# EAGLE design vmuzero_SEPS525_V2 (EAGLE 6.6.0)

## Sheet 1 of 5
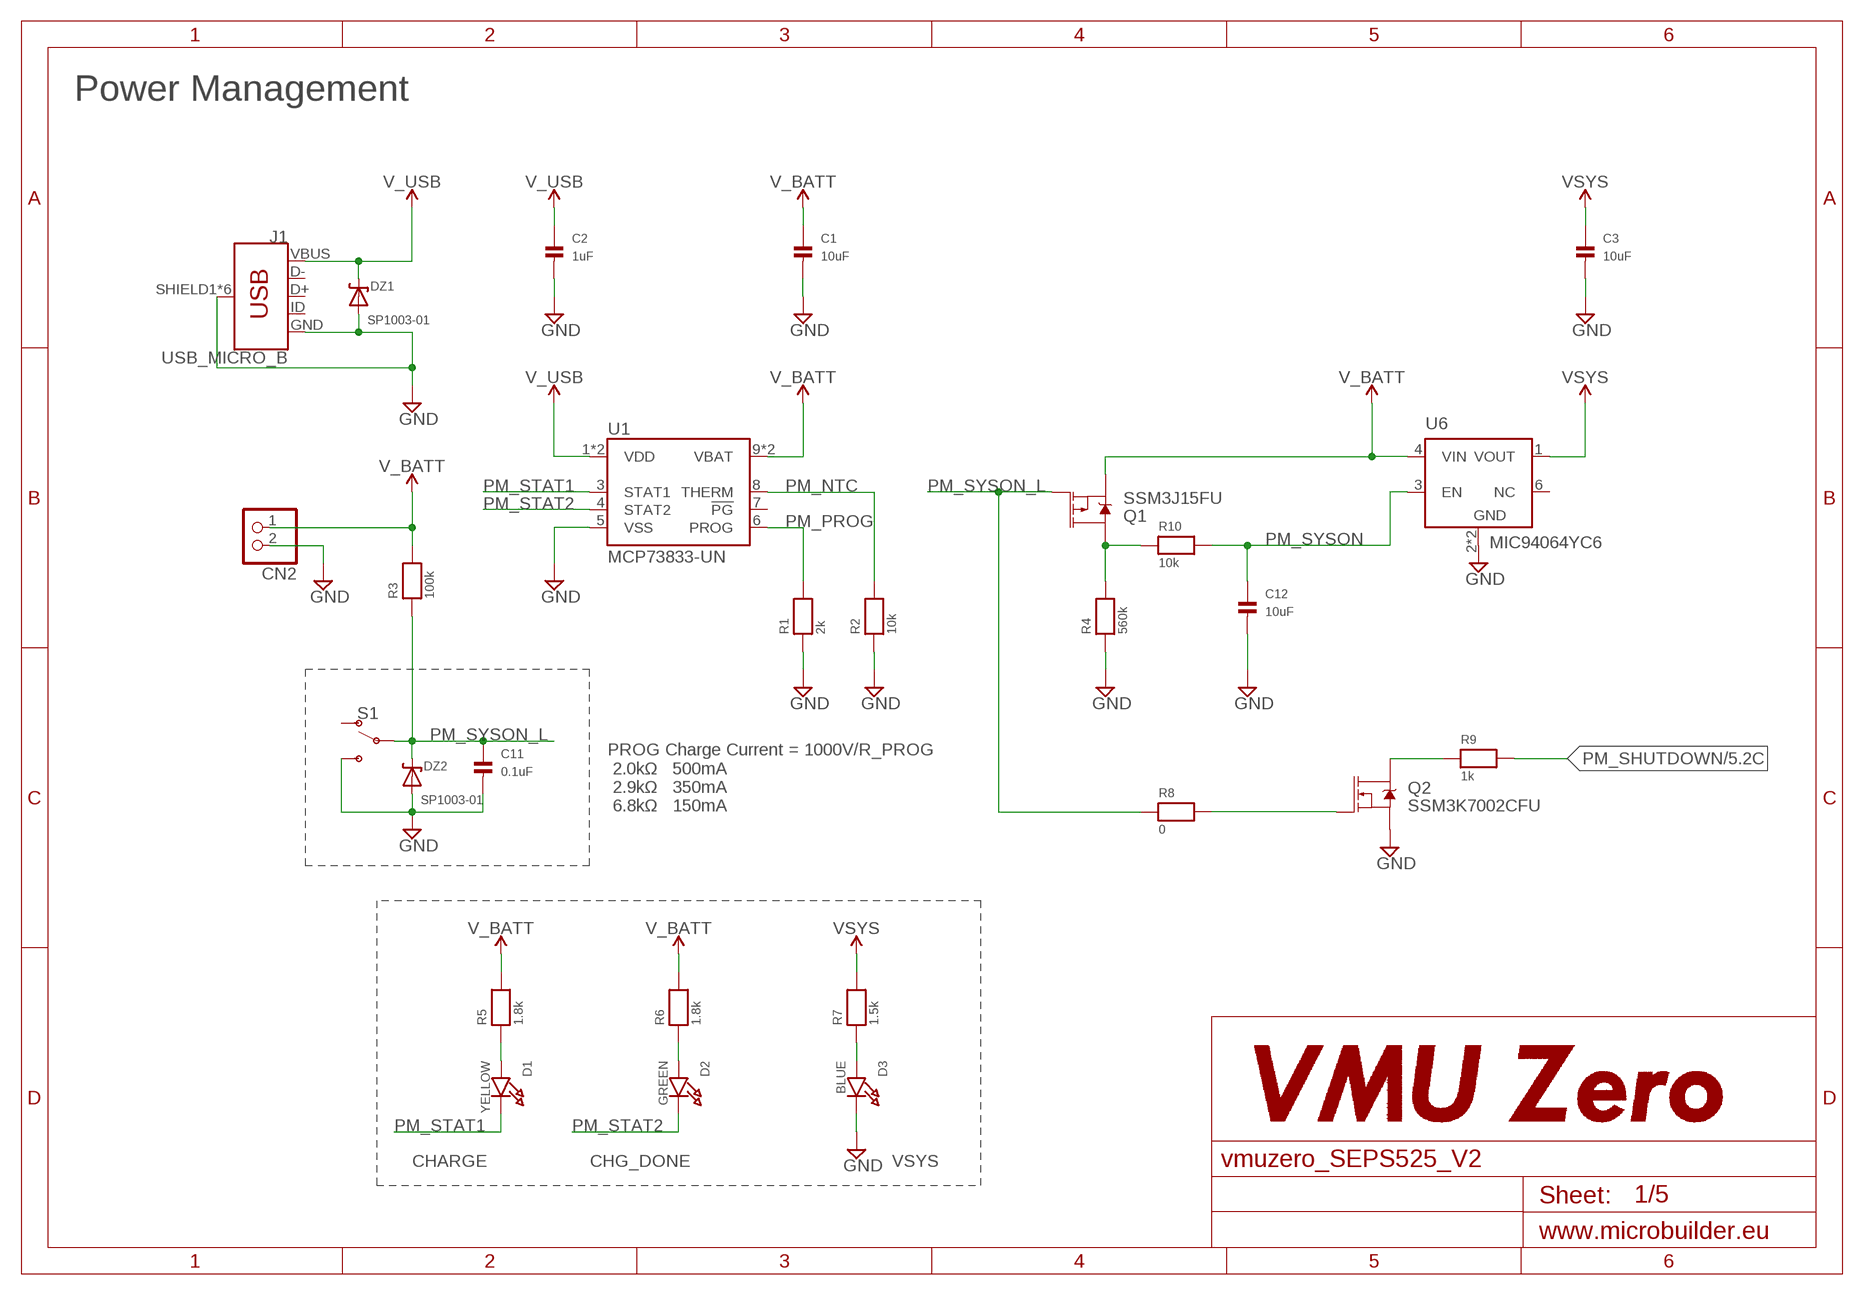
[diagram p0: schematic, sheet 1]

### Parts
C1  10uF  CAP_CERAMIC_0805MP  [_0805MP]
C2  1uF  CAP_CERAMIC_0805MP  [_0805MP]
C3  10uF  CAP_CERAMIC_0805MP  [_0805MP]
C11  0.1uF  CAP_CERAMIC_0805MP  [_0805MP]
C12  10uF  CAP_CERAMIC_0805MP  [_0805MP]
CN2  JST_2PIN  [S2B-PH-K-S]
D1  YELLOW  LED0805_NOOUTLINE  [CHIPLED_0805_NOOUTLINE]
D2  GREEN  LED0805_NOOUTLINE  [CHIPLED_0805_NOOUTLINE]
D3  BLUE  LED0805_NOOUTLINE  [CHIPLED_0805_NOOUTLINE]
DZ1  SP1003-01  SP1003-01D  [DIODE_SOD723]
DZ2  SP1003-01  SP1003-01D  [DIODE_SOD723]
J1  USB_MICRO_B  USB_MICRO-B_AMP_10118192  [USB-MICROB_10118192]
Q1  SSM3J15FU  MOSFET_PCH-SSM3J15FU  [SOT323]
Q2  SSM3K7002CFU  MOSFET_NCH-SSM3K7002CFU  [SOT323]
R1  2k  RESISTOR_0805MP  [_0805MP]
R2  10k  RESISTOR_0805MP  [_0805MP]
R3  100k  RESISTOR_0805MP  [_0805MP]
R4  560k  RESISTOR_0805MP  [_0805MP]
R5  1.8k  RESISTOR_0805MP  [_0805MP]
R6  1.8k  RESISTOR_0805MP  [_0805MP]
R7  1.5k  RESISTOR_0805MP  [_0805MP]
R8  0  RESISTOR_0805MP  [_0805MP]
R9  1k  RESISTOR_0805MP  [_0805MP]
R10  10k  RESISTOR_0805MP  [_0805MP]
S1  SWITCH-SPDT  [SPDT_JS102011SAQN]
U1  MCP73833-UN  [10L_MSOP]
U6  MIC94064YC6  [SC70-6L]

### Nets
GND: C1.2 C2.2 C3.2 C11.2 C12.2 CN2.2 D3.C DZ1.A DZ2.A J1.GND J1.SHIELD1(SHIELD) J1.SHIELD2(SHIELD) J1.SHIELD3(SHIELD) J1.SHIELD4(SHIELD) J1.SHIELD5(SHIELD) J1.SHIELD6(SHIELD) Q2.2(S) R1.1 R2.1 R4.1 S1.P$3(S) U1.5(VSS) U6.2(GND) U6.5(GND) ; also sheet 2,3,4,5
N$1: D1.A R5.1
N$2: Q2.3(D) R9.1
N$5: D3.A R7.1
N$6: D2.A R6.1
N$21: Q2.1(G) R8.2
N$22: Q1.3(D) R4.2 R10.1
PM_NTC: R2.2 U1.8(THERM)
PM_PROG: R1.2 U1.6(PROG)
PM_SHUTDOWN: R9.2 ; also sheet 5
PM_STAT1: D1.C U1.3(STAT1)
PM_STAT2: D2.C U1.4(STAT2)
PM_SYSON: C12.1 R10.2 U6.3(EN)
PM_SYSON_L: C11.1 DZ2.C Q1.1(G) R3.1 R8.1 S1.P$2(P)
V_BATT: C1.1 CN2.1 Q1.2(S) R3.2 R5.2 R6.2 U1.9(VBAT) U1.10(VBAT) U6.4(VIN)
V_USB: C2.1 DZ1.C J1.VBUS U1.1(VDD) U1.2(VDD)
VSYS: C3.1 R7.2 U6.1(VOUT) ; also sheet 2,5
Unconnected: J1.D+ J1.D- J1.ID S1.P$1(O) U1.7(!PG) U6.6(NC)

### Notes on the sheet
- Power Management
- PROG Charge Current = 1000V/R_PROG
   2.0kΩ   500mA
   2.9kΩ   350mA
   6.8kΩ   150mA
- CHARGE | CHG_DONE | VSYS

## Sheet 2 of 5
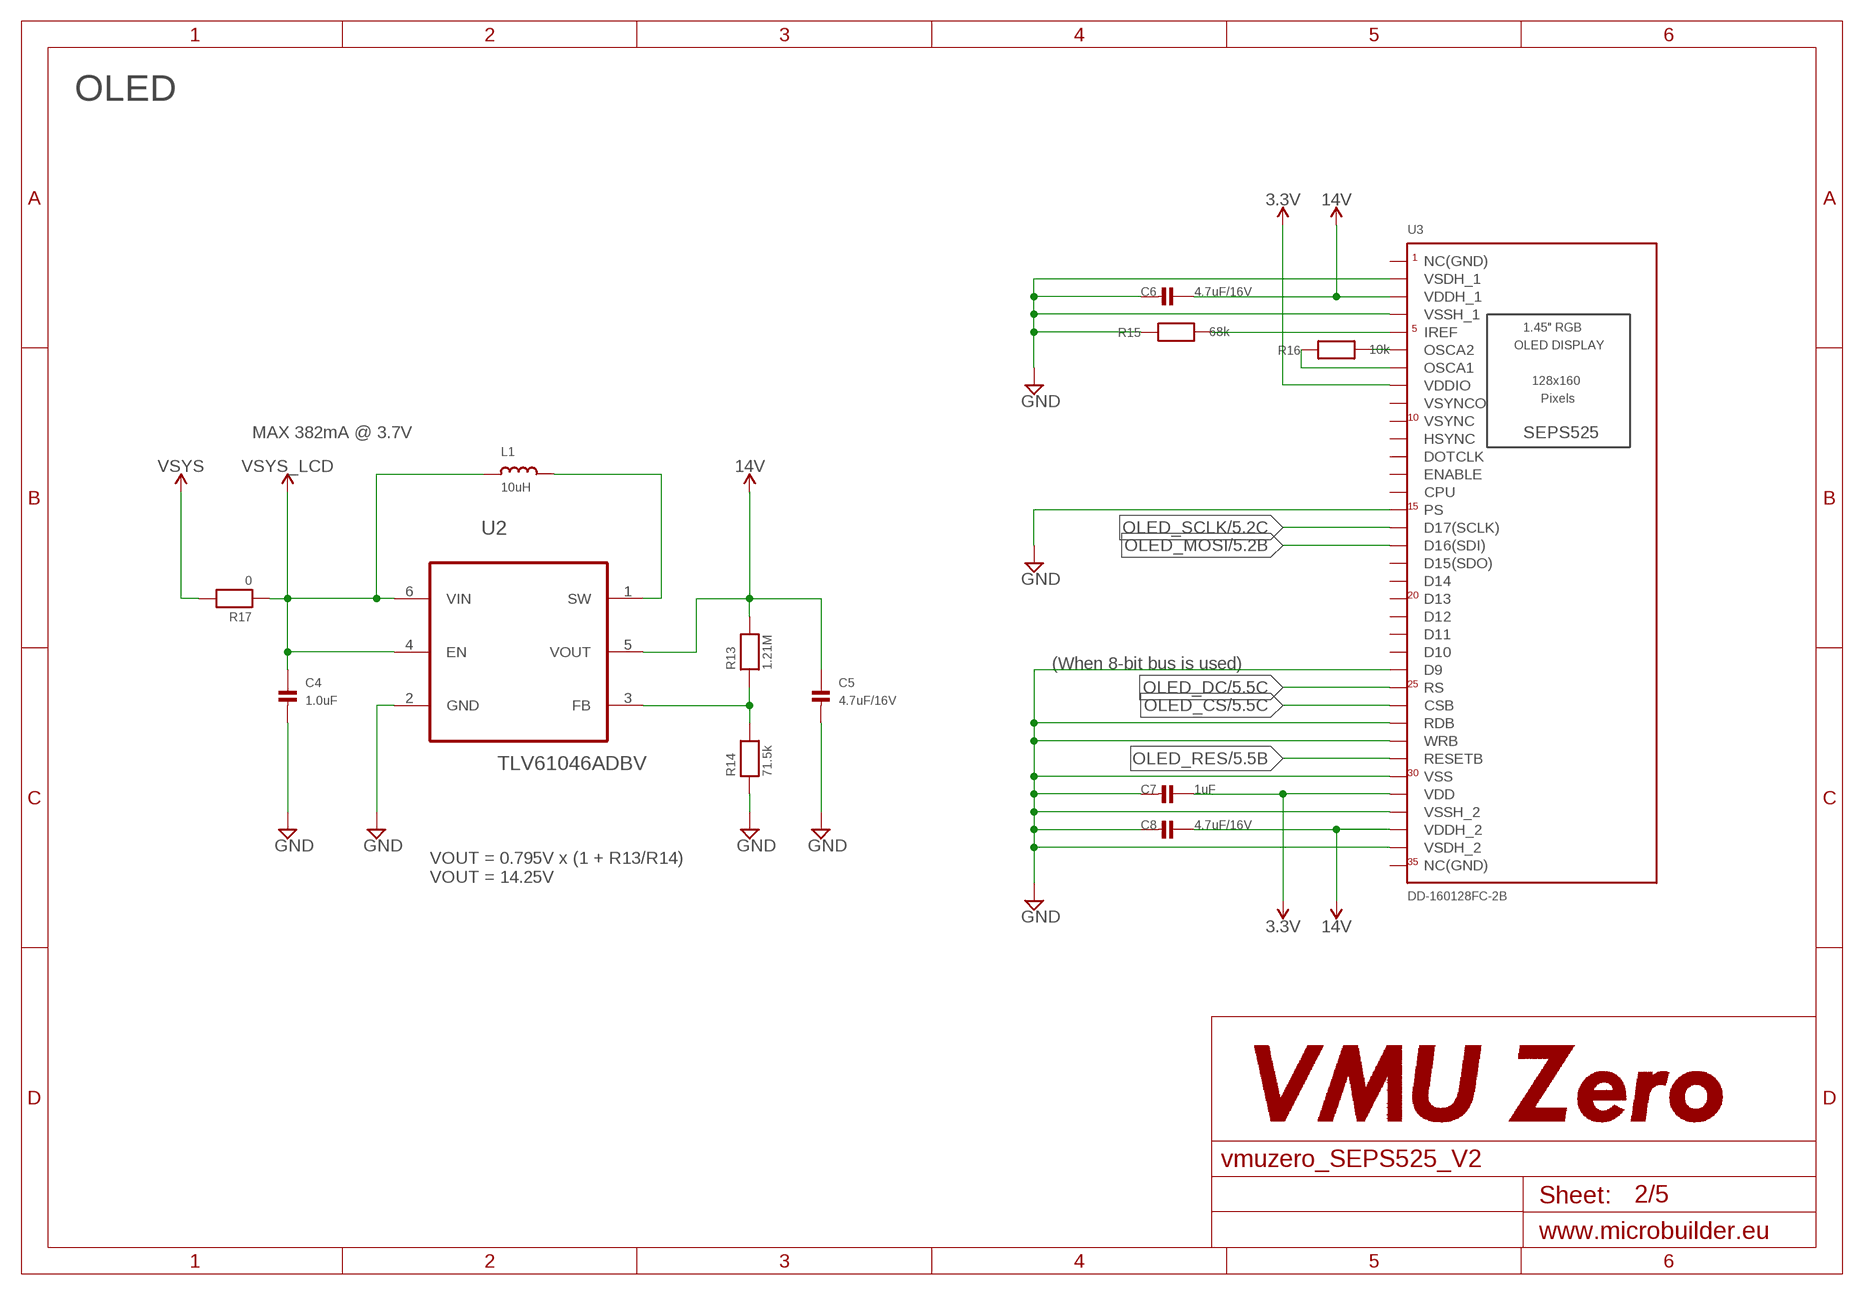
[diagram p1: schematic, sheet 2]

### Parts
C4  1.0uF  CAP_CERAMIC_0805MP  [_0805MP]
C5  4.7uF/16V  CAP_CERAMIC_0805MP  [_0805MP]
C6  4.7uF/16V  CAP_CERAMIC_0805MP  [_0805MP]
C7  1uF  CAP_CERAMIC_0805MP  [_0805MP]
C8  4.7uF/16V  CAP_CERAMIC_0805MP  [_0805MP]
L1  10uH  INDUCTOR_CIG22L  [CIG22L]
R13  1.21M  RESISTOR_0805MP  [_0805MP]
R14  71.5k  RESISTOR_0805MP  [_0805MP]
R15  68k  RESISTOR_0805MP  [_0805MP]
R16  10k  RESISTOR_0805MP  [_0805MP]
R17  0  RESISTOR_0805MP  [_0805MP]
U2  TLV61046ADBV  [R-PDSO-G6]
U3  DD-160128FC-2B  DISP_OLED_DD-160128FC-2BNOSWAP  [XF2M-3515-1A]

### Nets
3.3V: C7.1 U3.8(VDDIO) U3.31(VDD) ; also sheet 5
14V: C5.1 C6.1 C8.1 R13.2 U2.5(VOUT) U3.3(VDDH_1) U3.33(VDDH_2) ; also sheet 4
GND: C4.2 C5.2 C6.2 C7.2 C8.2 R14.1 R15.2 U2.2(GND) U3.2(VSDH_1) U3.4(VSSH_1) U3.15(PS) U3.24(D9) U3.27(RDB) U3.28(WRB) U3.30(VSS) U3.32(VSSH_2) U3.34(VSDH_2) ; also sheet 1,3,4,5
N$7: R15.1 U3.5(IREF)
N$8: L1.P$2 U2.1(SW)
N$9: R13.1 R14.2 U2.3(FB)
N$10: R16.1 U3.6(OSCA2)
N$11: R16.2 U3.7(OSCA1)
OLED_CS: U3.26(CSB) ; also sheet 5
OLED_DC: U3.25(RS) ; also sheet 5
OLED_MOSI: U3.17(D16(SDI)) ; also sheet 5
OLED_RES: U3.29(RESETB) ; also sheet 5
OLED_SCLK: U3.16(D17(SCLK)) ; also sheet 5
VSYS: R17.2 ; also sheet 1,5
VSYS_LCD: C4.1 L1.P$1 R17.1 U2.4(EN) U2.6(VIN)
Unconnected: U3.1(NC(GND)) U3.9(VSYNCO) U3.10(VSYNC) U3.11(HSYNC) U3.12(DOTCLK) U3.13(ENABLE) U3.14(CPU) U3.18(D15(SDO)) U3.19(D14) U3.20(D13) U3.21(D12) U3.22(D11) U3.23(D10) U3.35(NC(GND))

### Notes on the sheet
- OLED
- MAX 382mA @ 3.7V
- (When 8-bit bus is used)
- VOUT = 0.795V x (1 + R13/R14)
  VOUT = 14.25V

## Sheet 3 of 5
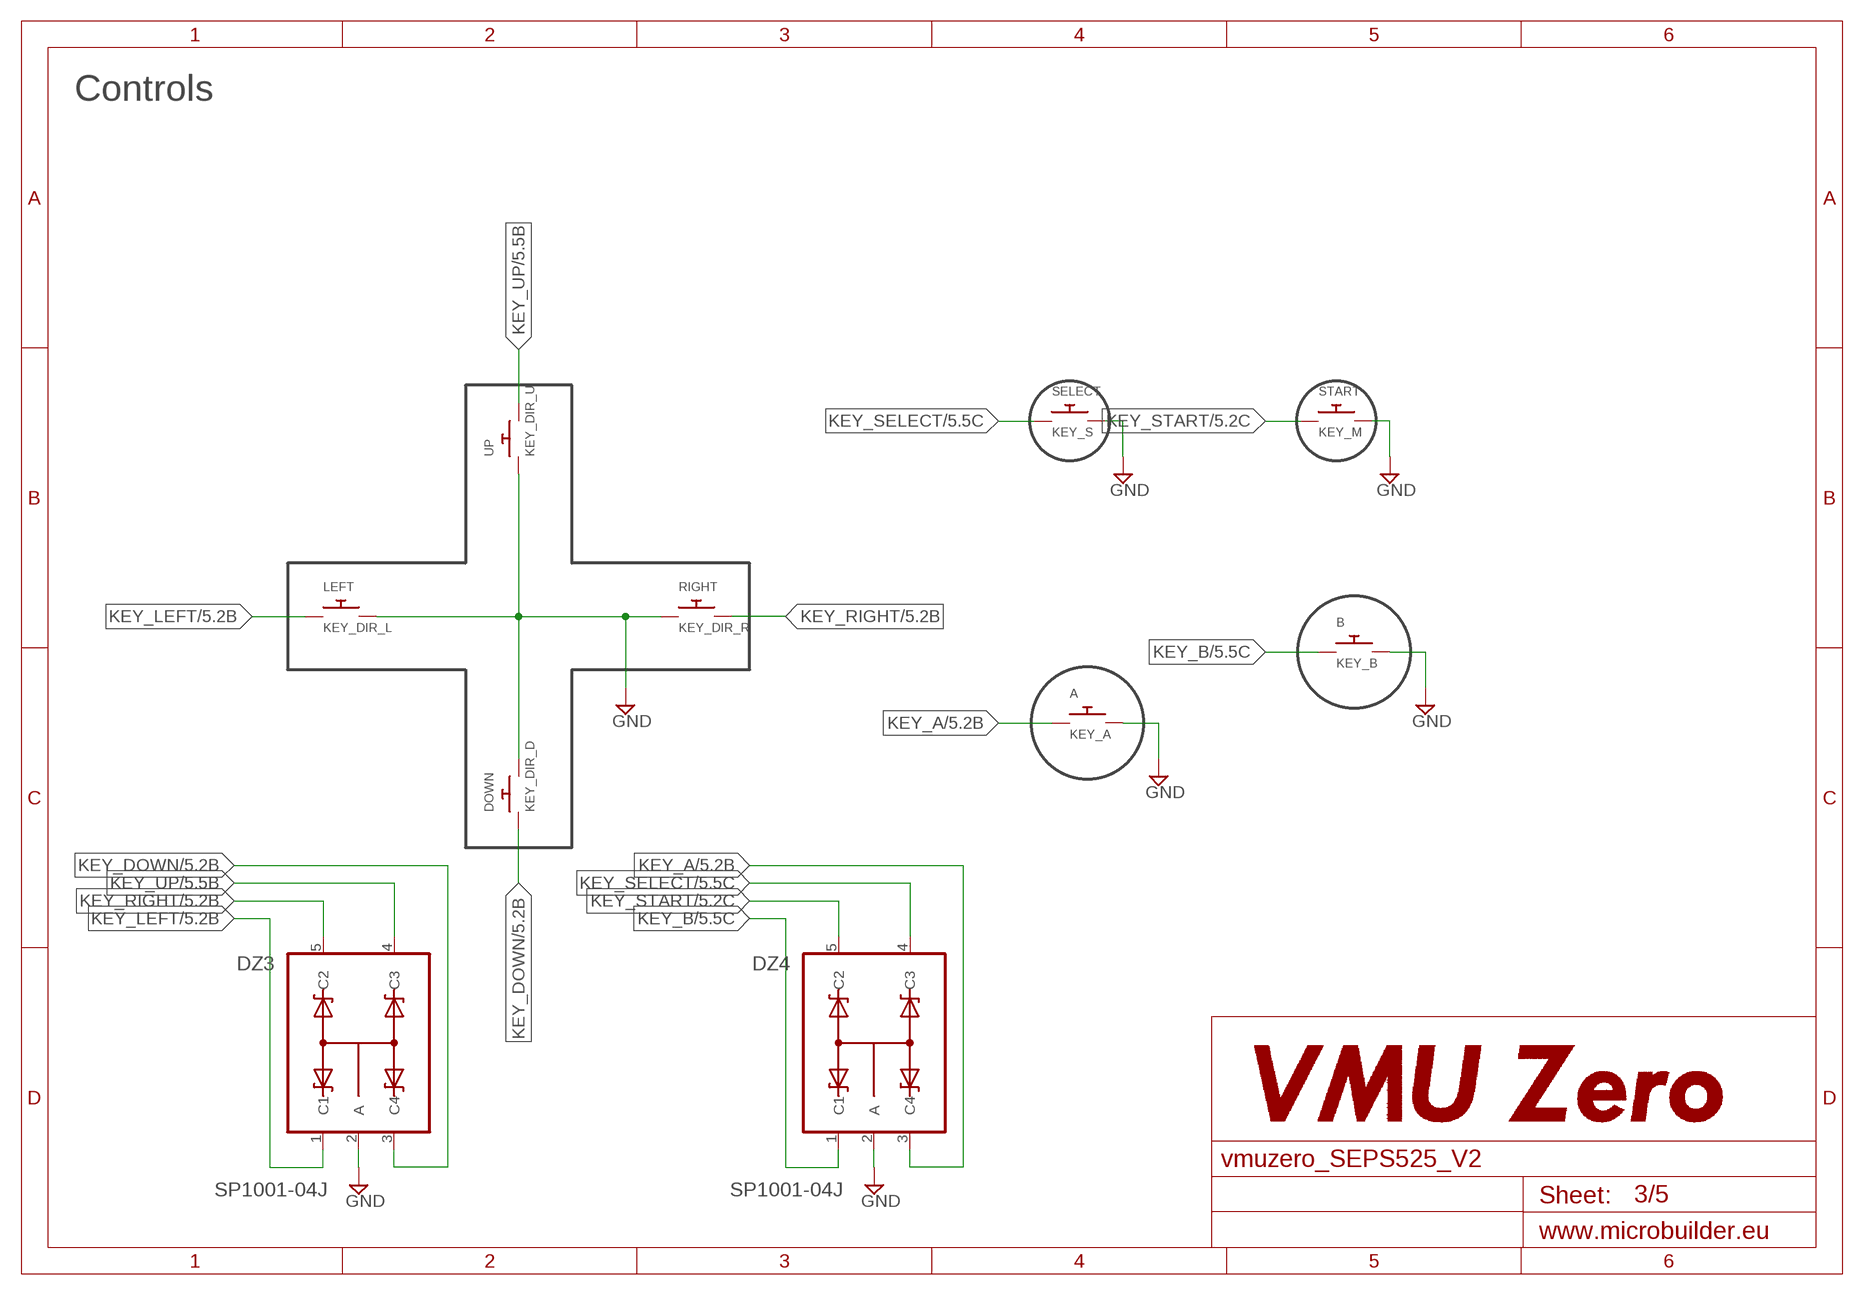
[diagram p2: schematic, sheet 3]

### Parts
A  KEY_A  SWITCH_PUSH_VMU  [KEYPAD_VMU_R26]
B  KEY_B  SWITCH_PUSH_VMU  [KEYPAD_VMU_R26]
DOWN  KEY_DIR_D  SWITCH_PUSH_VMU  [KEYPAD_VMU_R26]
DZ3  SP1001-04J  [SC70-5]
DZ4  SP1001-04J  [SC70-5]
LEFT  KEY_DIR_L  SWITCH_PUSH_VMU  [KEYPAD_VMU_R26]
RIGHT  KEY_DIR_R  SWITCH_PUSH_VMU  [KEYPAD_VMU_R26]
SELECT  KEY_S  SWITCH_PUSH_VMU  [KEYPAD_VMU_R26]
START  KEY_M  SWITCH_PUSH_VMU  [KEYPAD_VMU_R26]
UP  KEY_DIR_U  SWITCH_PUSH_VMU  [KEYPAD_VMU_R26]

### Nets
GND: A.2 B.2 DOWN.2 DZ3.2(A) DZ4.2(A) LEFT.2 RIGHT.1 SELECT.2 START.2 UP.1 ; also sheet 1,2,4,5
KEY_A: A.1 DZ4.3(C4) ; also sheet 5
KEY_B: B.1 DZ4.1(C1) ; also sheet 5
KEY_DOWN: DOWN.1 DZ3.3(C4) ; also sheet 5
KEY_LEFT: DZ3.1(C1) LEFT.1 ; also sheet 5
KEY_RIGHT: DZ3.5(C2) RIGHT.2 ; also sheet 5
KEY_SELECT: DZ4.4(C3) SELECT.1 ; also sheet 5
KEY_START: DZ4.5(C2) START.1 ; also sheet 5
KEY_UP: DZ3.4(C3) UP.2 ; also sheet 5

### Notes on the sheet
- Controls

## Sheet 4 of 5
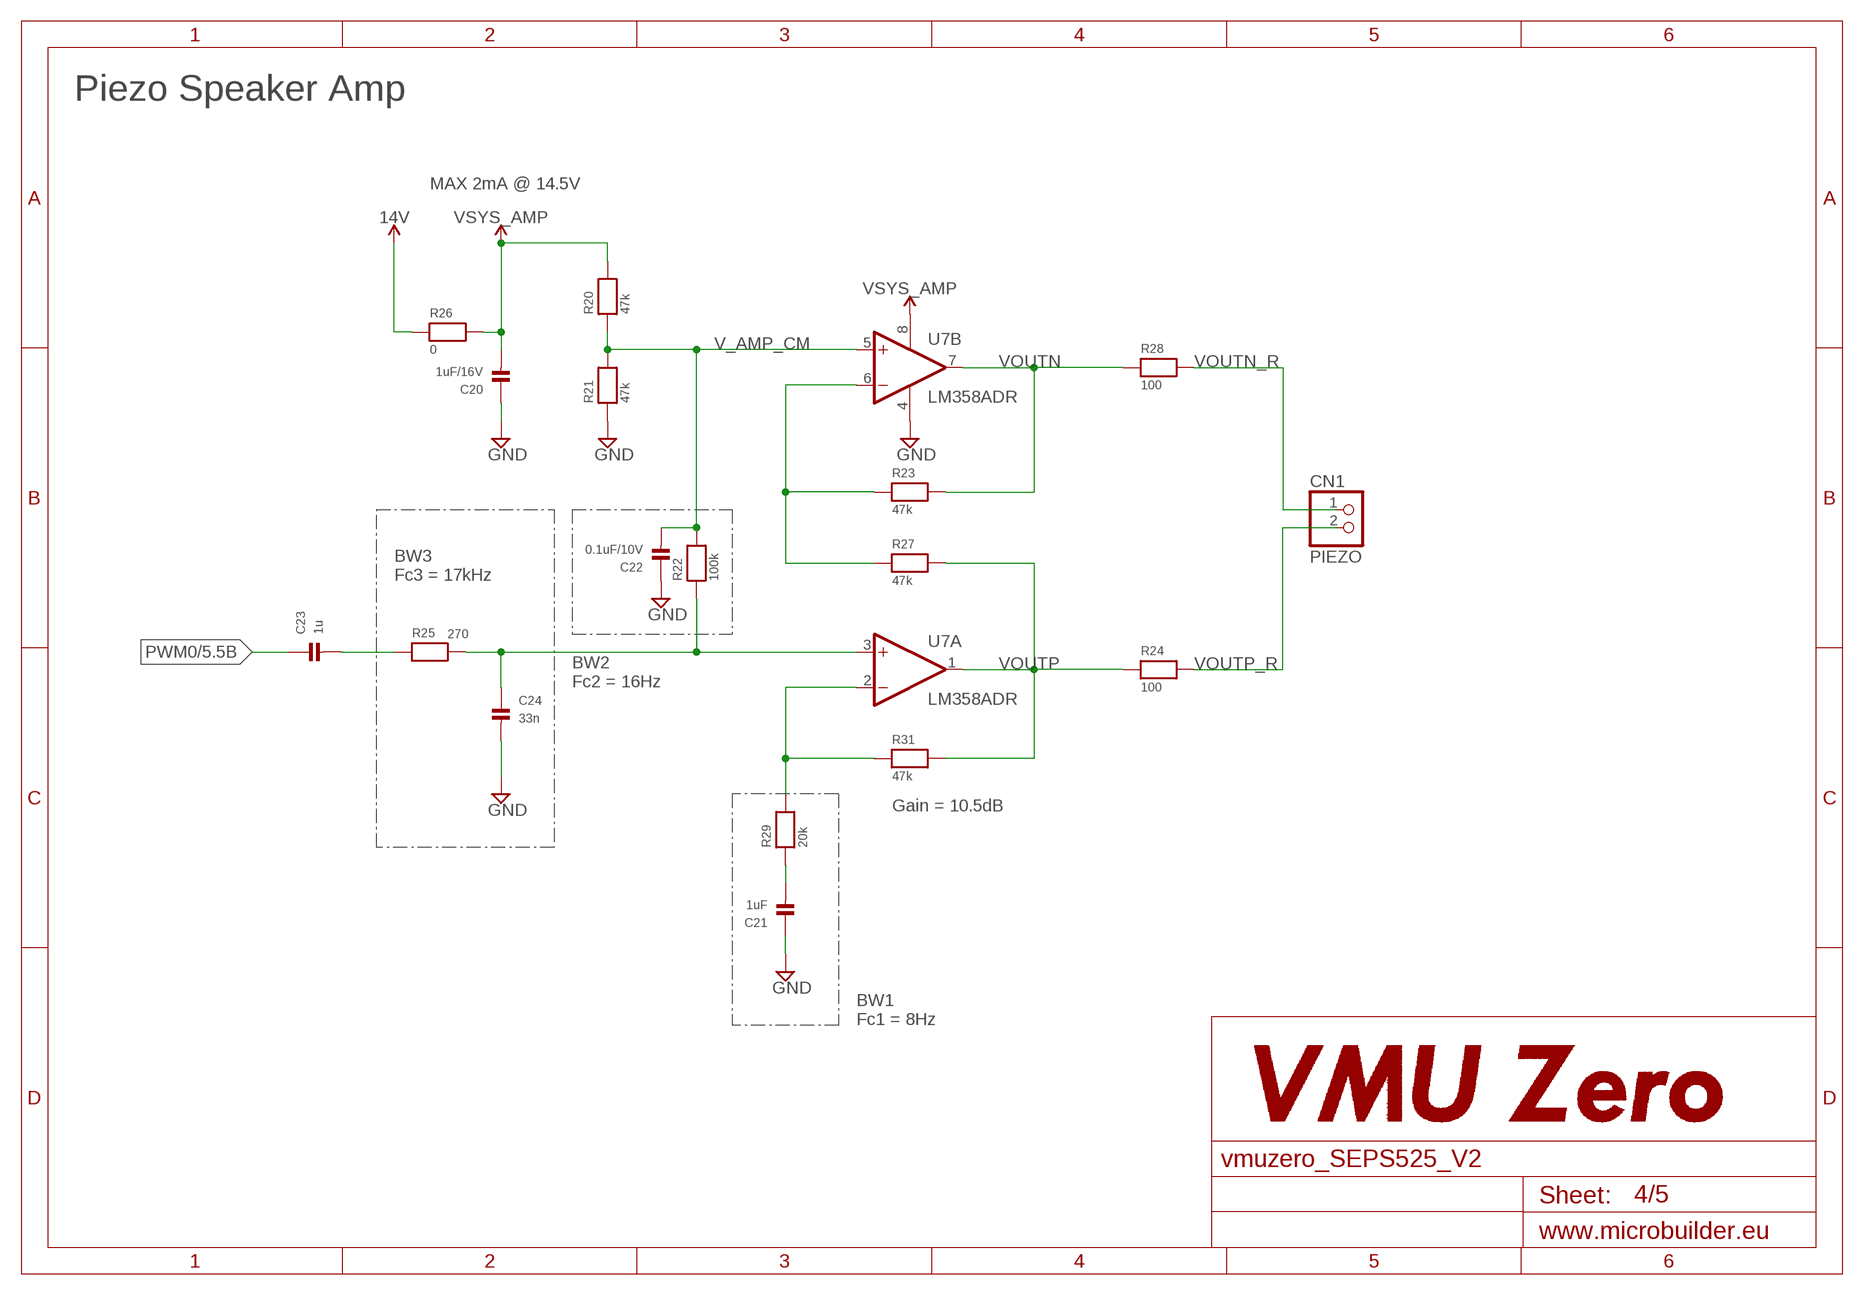
[diagram p3: schematic, sheet 4]

### Parts
C20  1uF/16V  CAP_CERAMIC_0805MP  [_0805MP]
C21  1uF  CAP_CERAMIC_0805MP  [_0805MP]
C22  0.1uF/10V  CAP_CERAMIC_0805MP  [_0805MP]
C23  1u  CAP_CERAMIC_0805MP  [_0805MP]
C24  33n  CAP_CERAMIC_0805MP  [_0805MP]
CN1  PIEZO  HEADER-1X2ROUND  [1X02_ROUND]
R20  47k  RESISTOR_0805MP  [_0805MP]
R21  47k  RESISTOR_0805MP  [_0805MP]
R22  100k  RESISTOR_0805MP  [_0805MP]
R23  47k  RESISTOR_0805MP  [_0805MP]
R24  100  RESISTOR_0805MP  [_0805MP]
R25  270  RESISTOR_0805MP  [_0805MP]
R26  0  RESISTOR_0805MP  [_0805MP]
R27  47k  RESISTOR_0805MP  [_0805MP]
R28  100  RESISTOR_0805MP  [_0805MP]
R29  20k  RESISTOR_0805MP  [_0805MP]
R31  47k  RESISTOR_0805MP  [_0805MP]
U7  LM358ADR  [SO08]

### Nets
14V: R26.1 ; also sheet 2
GND: C20.1 C21.1 C22.1 C24.2 R21.1 U7.4(P:V-) ; also sheet 1,2,3,5
N$3: C23.2 R25.1
N$12: R29.2 R31.1 U7.2(A:-IN)
N$13: C21.2 R29.1
N$16: R23.1 R27.1 U7.6(B:-IN)
N$20: C24.1 R22.1 R25.2 U7.3(A:+IN)
PWM0: C23.1 ; also sheet 5
V_AMP_CM: C22.2 R20.1 R21.2 R22.2 U7.5(B:+IN)
VOUTN: R23.2 R28.1 U7.7(B:OUT)
VOUTN_R: CN1.1 R28.2
VOUTP: R24.1 R27.2 R31.2 U7.1(A:OUT)
VOUTP_R: CN1.2 R24.2
VSYS_AMP: C20.2 R20.2 R26.2 U7.8(P:V+)

### Notes on the sheet
- Piezo Speaker Amp
- MAX 2mA @ 14.5V
- BW3
  Fc3 = 17kHz
- BW2
  Fc2 = 16Hz
- Gain = 10.5dB
- BW1
  Fc1 = 8Hz

## Sheet 5 of 5
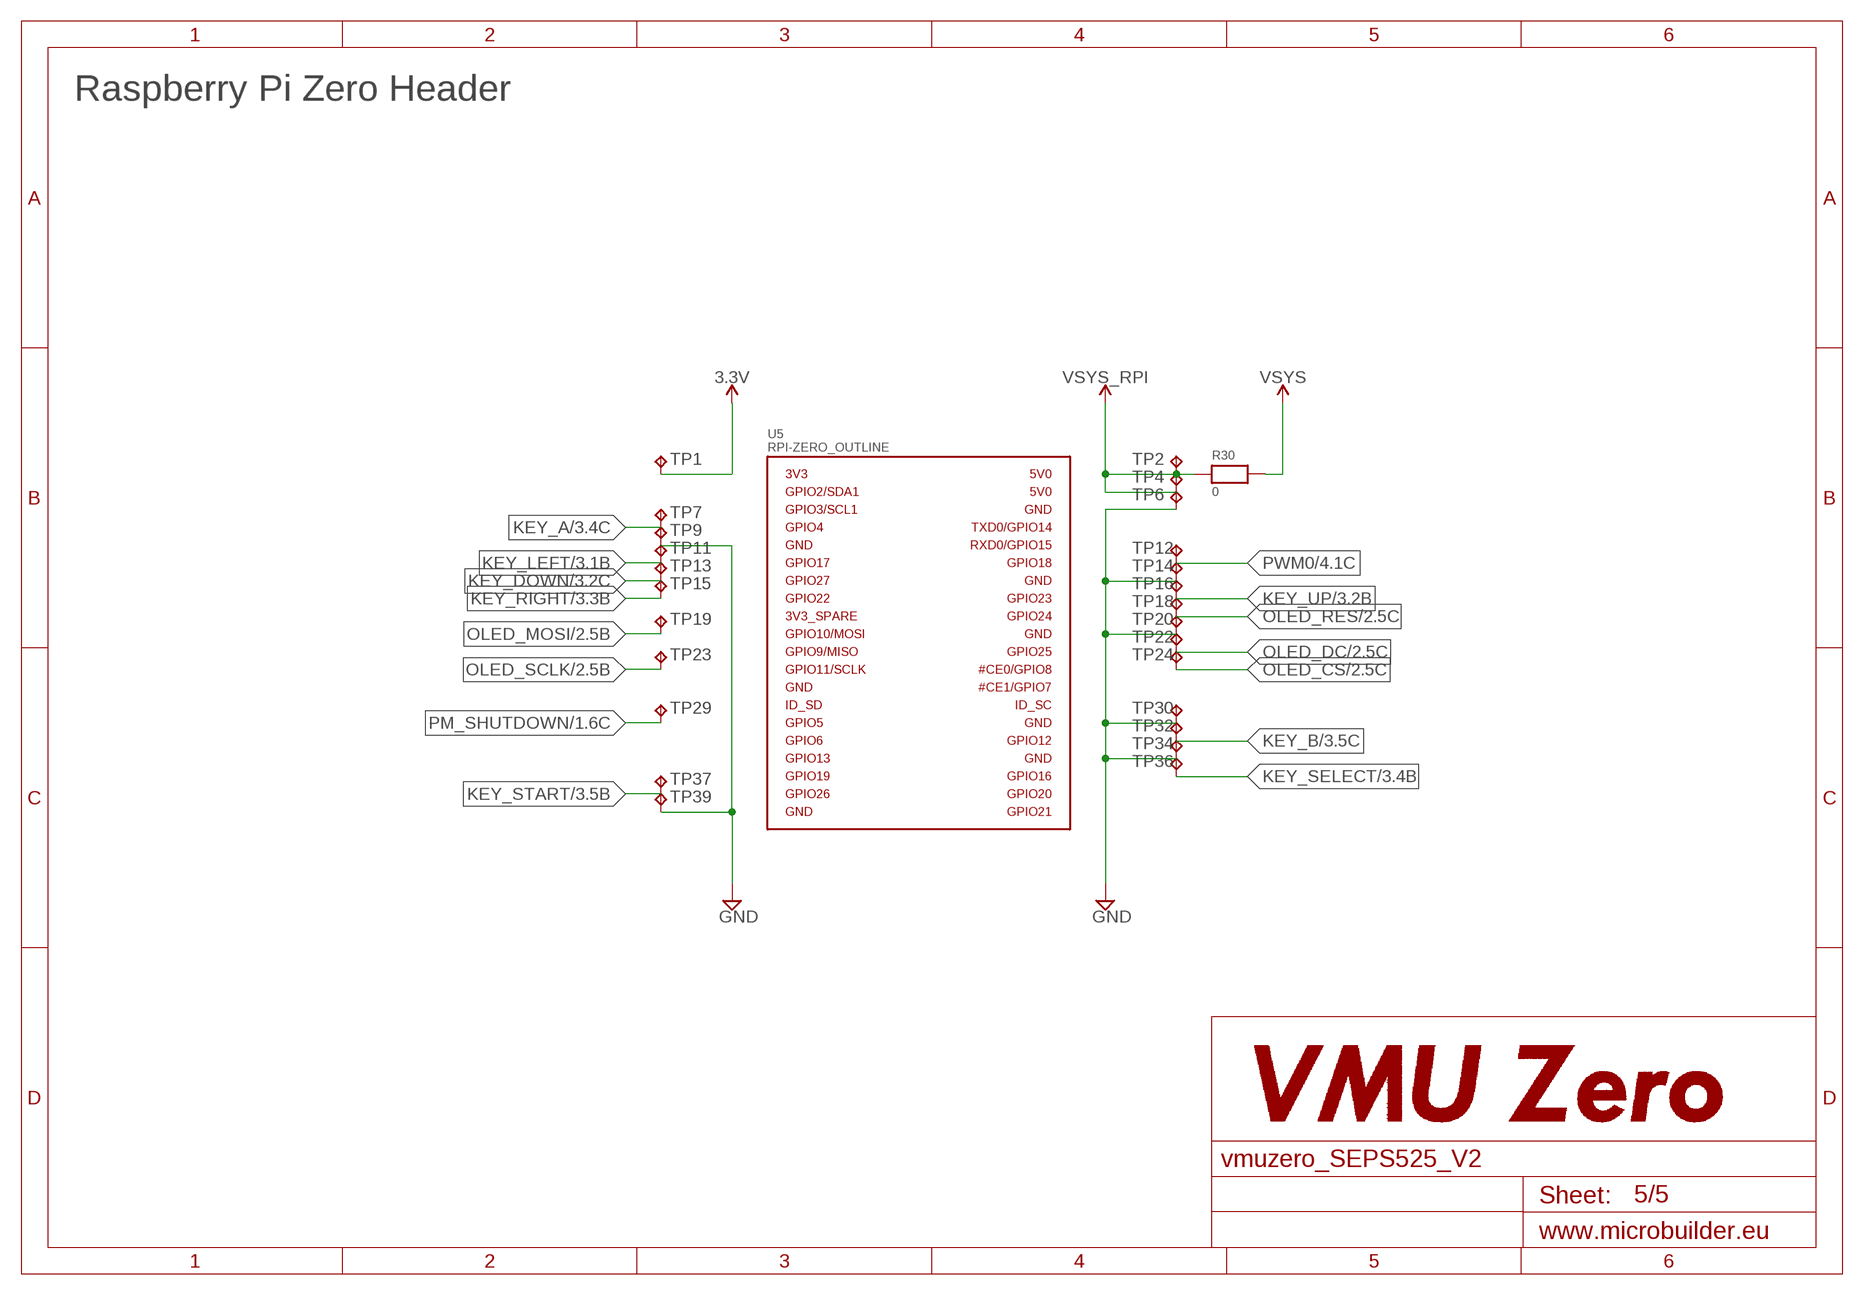
[diagram p4: schematic, sheet 5]

### Parts
R30  0  RESISTOR_0805MP  [_0805MP]
TP1  TPTP14SQ  [TP14SQ]
TP2  TPTP14R  [TP14R]
TP4  TPTP14R  [TP14R]
TP6  TPTP14R  [TP14R]
TP7  TPTP14R  [TP14R]
TP9  TPTP14R  [TP14R]
TP11  TPTP14R  [TP14R]
TP12  TPTP14R  [TP14R]
TP13  TPTP14R  [TP14R]
TP14  TPTP14R  [TP14R]
TP15  TPTP14R  [TP14R]
TP16  TPTP14R  [TP14R]
TP18  TPTP14R  [TP14R]
TP19  TPTP14R  [TP14R]
TP20  TPTP14R  [TP14R]
TP22  TPTP14R  [TP14R]
TP23  TPTP14R  [TP14R]
TP24  TPTP14R  [TP14R]
TP29  TPTP14R  [TP14R]
TP30  TPTP14R  [TP14R]
TP32  TPTP14R  [TP14R]
TP34  TPTP14R  [TP14R]
TP36  TPTP14R  [TP14R]
TP37  TPTP14R  [TP14R]
TP39  TPTP14R  [TP14R]
U5  RPI-ZERO_OUTLINE  [RASP_PI_ZERO_OUTLINE_SMD]

### Nets
3.3V: TP1.TP ; also sheet 2
GND: TP6.TP TP9.TP TP14.TP TP20.TP TP30.TP TP34.TP TP39.TP ; also sheet 1,2,3,4
KEY_A: TP7.TP ; also sheet 3
KEY_B: TP32.TP ; also sheet 3
KEY_DOWN: TP13.TP ; also sheet 3
KEY_LEFT: TP11.TP ; also sheet 3
KEY_RIGHT: TP15.TP ; also sheet 3
KEY_SELECT: TP36.TP ; also sheet 3
KEY_START: TP37.TP ; also sheet 3
KEY_UP: TP16.TP ; also sheet 3
OLED_CS: TP24.TP ; also sheet 2
OLED_DC: TP22.TP ; also sheet 2
OLED_MOSI: TP19.TP ; also sheet 2
OLED_RES: TP18.TP ; also sheet 2
OLED_SCLK: TP23.TP ; also sheet 2
PM_SHUTDOWN: TP29.TP ; also sheet 1
PWM0: TP12.TP ; also sheet 4
VSYS: R30.2 ; also sheet 1,2
VSYS_RPI: R30.1 TP2.TP TP4.TP

### Notes on the sheet
- Raspberry Pi Zero Header

## Library data of the parts
A B DOWN LEFT RIGHT SELECT START UP = vmuzero:SWITCH_PUSH_VMU: Buttons SWITCH_PUSH_VMU - Soft touch temporary push button for VMU
C1-C8 C11 C12 C20-C24 = microbuilder:CAP_CERAMIC: Ceramic Capacitors 0402 - 0402 Surface Mount Capacitors 16pF 50V 5% [Digikey: 445-4899-2-ND] 18pF 50V 5% [Digikey: 490-1281-2-ND] 22pF 50V 5% [Digikey: 490-1283-2-ND] 68pF 50V 5% [Digikey: 490-1289-2-ND] 0.1uF 10V 10% [Digikey: 490-1318-2-ND] 1.0uF 6.3V 10% [Digikey: 490-1320-2-ND] 0603 - 0603 Surface Mount Capacitors 16 pF 50V 5% [Digikey: 445-5051-2-ND] 22 pF 50V [Digikey: PCC220ACVTR-ND] 33 pF 50V 5% [Digikey: 490-1415-1-ND] 56pF 50V 5% [Digikey: 490-1421-1-ND] 220pF 50V 5% [Digikey: 445-1285-1-ND] 680 pF 50V 2200 pF 50V 5% C0G [Digikey: 445-1297-1-ND] 5600 pF 100V 5% X7R [Digikey: 478-3711-1-ND] 0.1 µF 25V 10% [Digikey: PCC2277TR-ND] 0.22 µF 16V 10% X7R [Digikey: 445-1318-1-ND] 1.0 µF 25V 10% [Digikey: 445-5146-2-ND] 0603 - RF Specific 3pF 250V +/-0.1pF RF [Digikey: 712-1347-1-ND] 18 pF 250V 5% [Digikey: 478-3505-1-ND or 712-1322-1-ND] 56 pF 250V 5% C0G RF [Digikey: 490-4867-1-ND] 68 pF 250V RF [Digikey: 490-4868-1-ND] 0805 - 0805 Surface Mount Capacitors 220 pF 250V 2% RF Ceramic Capacitor [Digikey: 712-1398-1-ND] 1000 pF 50V 2% NP0 Ceramic Capacitor [Digikey: 478-3760-1-ND] 0.1 µF 25V 10% Ceramic Capacitor [Digikey: PCC1828TR-ND] 1.0 µF 16V 10% Ceramic Capacitor[Digikey: 490-1691-2-ND] 10.0 µF 10V 10% Ceramic Capacitor[Digikey: 709-1228-1-ND] 10.0 uF 16V 10% Ceramic Capacitor [Digikey: 478-5165-2-ND] 47 uF 6.3V 20% Ceramic Capacitor [Digikey: 587-1779-1-ND or 399-5506-1-ND] 1206 - 1206 Surface Mount Capacitors 47uF 10V 20% Ceramic Capacitor [Digikey: 490-5528-1-ND or 399-5508-1-ND or 445-6010-1-ND] 100uF 6.3V -20%, +80% Y5V Ceramic Capacitor (Digikey: 490-4512-1-ND, Mouser: 81-GRM31CF50J107ZE1L)
CN1 = microbuilder:HEADER-1X2: PIN HEADER
CN2 = vmuzero:JST_2PIN: JST 2-Pin Connectors of various flavors SMT-RA (S2B-PH-SM4) 4UConnector #17311 SMT (B2B-PH-SM4) THM-RA (S2B-PH) THM (B2B-PH)
D1-D3 = microbuilder:LED: LED 0603 - 0603 Surface Mount Package 2mA: Green LED - Low Power (3.9mcd, 2ma, 1.7Vf) - Digikey: 475-2709-2-ND Orange LED - Low Power (9.8mcd, 2ma, 1.8Vf) - Digikey: 475-1194-2-ND Red LED - Low Power (5mcd, 2ma, 1.8Vf) - Digikey: 475-1195-2-ND Yellow LED - Low Power (7mcd, 2ma, 1.8Vf) - Digikey: 475-1196-2-ND 5mA: Blue LED - Low Power (17mcd, 5ma, 2.9Vf) - Digikey: LNJ937W8CRACT-ND 0805 - 0805 Surface Mount Package 2mA: Red LED (8.8mcd, 2mA, 1.8Vf, Clear) - Low Power [Digikey: 475-2510-1-ND] Green LED (5mcd, 2mA, 1.8Vf, Clear) - Low Power [Digikey: 475-2730-1-ND] Yellow LED (11.3mcd, 2mA, 1.8Vf, Clear) - Low Power [Digikey: 475-2555-1-ND] 20mA: Red LED (104mcd, 20mA, Diffused) - LS R976 [Digikey: 475-1278-6-ND] Red LED (12mcd, 20mA, 2.0Vf, Clear) - APT2012EC [Digikey: 754-1128-1-ND] Green LED (15mcd, 20mA, 2.2Vf, Clear) - APT2012GC [Digikey: 754-1131-1-ND] Orange LED (160mcd, 20mA, 2.1Vf, Clear) - APT2012SECK [Digikey: 754-1130-1-ND] 1206 - 1206 Surface Mount Package Green LED (26mcd, 20mA, Diffused) - LG N971 [Digikey: 475-1407-6-ND] Red LED (15mcd, 20mA, Diffused) - LH N974 [Digikey: 475-1416-6-ND]
DZ1 DZ2 = vmuzero:SP1003-01: Zener Diode SMA: SP1003 Series - 30pF 30kV Unidirectional Discrete TVS; DIGIKEY: F3377CT-ND; MPN: SP1003-01; SUPPLIER: Littelfuse
DZ3 DZ4 = vmuzero:SP1001-04: SP1001 Series - 8pF 15kV Unidirectional TVS Array; DIGIKEY: F2895CT-ND; MPN: SP1001-04; PACKAGE: SC70-5; SUPPLIER: Littelfuse
J1 = vmuzero:USB_MICRO-B: USB Type Micro-B Connector; DIGIKEY: ‎609-4613-1-ND‎; MPN: 10118192-0001LF‎; SUPPLIER: Amphenol FCI
L1 = vmuzero:INDUCTOR: Inductors 1210 (3512 metric): Murata LQH32CN470K23L 47uH 170mA 1.7Ω H=2.2mm (Digikey: 490-2497-1-ND) Murata LQH32CN470K53L 47uH 170mA 1.7Ω H=1.7mm (Digikey: 490-4063-1-ND) 1008 (2520 metric): Murata LQH2HPZ100MJRL 10uH 830mA 456mΩ H=1.0mm (Digikey: 490-15888-1-ND ) Samsung CIG22L100MNE 10uH 600mA 323mΩ (Digikey:1276-6215-1-ND); SUPPLIER: Samsung EM
Q1 = vmuzero:MOSFET_PCH: P-channel MOSFETs Voltage controlled devices that allow control of high current outputs.; MANUFACTURER: Toshiba; VALUE: 0.1A/30V/12Ω
Q2 = vmuzero:MOSFET_NCH: N-channel MOSFETs Voltage controlled devices that allow control of high current outputs.; MANUFACTURER: Toshiba; VALUE: 170mA/60V/3.9Ω
R1-R10 R13-R17 R20-R31 = microbuilder:RESISTOR: Resistors 0402 - 0402 Surface Mount Package 22 Ohm 1% 1/16W [Digikey: 311-22.0LRTR-ND] 33 Ohm 5% 1/16W 1.0K 5% 1/16W 1.5K 5% 1/16W 2.0K 1% 1/16W 10.0K 1% 1/16W [Digikey: 311-10.0KLRTR-ND] 10.0K 5% 1/16W [Digikey: RMCF0402JT10K0TR-ND] 12.1K 1% 1/16W [Digikey: 311-22.0LRTR-ND] 100.0K 5% 1/16W 0603 - 0603 Surface Mount Package 0 Ohm 1/10 Watt 1% Resistor 15 Ohm 1/10 Watt 1% Resistor 33 Ohm 1/10 Watt 1% Resistor 49.9 Ohm 1/10 Watt 1% Resistor 100 Ohm 1/10 Watt 1% Resistor 150 Ohm 1/10 Watt 1% Resistor 240 Ohm 1/10 Watt 1% Resistor 390 Ohm 1/10 Watt 1% Resistor 560 Ohm 1/10 Watt 1% Resistor 680 Ohm 1/10 Watt 1% Resistor 750 Ohm 1/10 Watt 1% Resistor 1.0K Ohm 1/10 Watt 1% Resistor 1.5K Ohm 1/10 Watt 1% Resistor 2.0K Ohm 1/10 Watt 1% Resistor 2.2K Ohm 1/10 Watt 1% Resistor 3.3K Ohm 1/10 Watt 1% Resistor 4.7K Ohm 1/10 Watt 1% Resistor 10.0K Ohm 1/10 Watt 1% Resistor 12.0K Ohm 1/10 Watt 1% Resistor 12.1K Ohm 1/10 Watt 1% Resistor 20.0K Ohm 1/10 Watt 1% Resistor 33.0K Ohm 1/10 Watt 1% Resistor 100.0K Ohm 1/10 Watt 1% Resistor 0805 - 0805 Surface Mount Package 0 Ohm 1/8 Watt 1% Resistor 33 Ohm 1/8 Watt 1% Resistor 100 Ohm 1/8 Watt 1% Resistor 150 Ohm 1/8 Watt 1% Resistor 200 Ohm 1/8 Watt 1% Resistor 240 Ohm 1/8 Watt 1% Resistor 330 Ohm 1/8 Watt 1% Resistor 390 Ohm 1/8 Watt 1% Resistor 470 Ohm 1/8 Watt 1% Resistor 1.0K Ohm 1/8 Watt 1% Resistor 1.5K Ohm 1/8 Watt 1% Resistor 2.0K Ohm 1/8 Watt 1% Resistor 4.7K Ohm 1/8 Watt 1% Resistor 5.1K Ohm 1/8 Watt 1% Resistor 5.6K Ohm 1/8 Watt 1% Resistor 10.0K Ohm 1/8 Watt 1% Resistor 22.0K Ohm 1/8 Watt 1% Resistor 33.0K Ohm 1/8 Watt 1% Resistor 100K Ohm 1/8 Watt 1% Resistor 1206 - 1206 Surface Mount Package 2012 - 2010 Surface Mount Package 0.11 Ohm 1/2 Watt 1% Resistor - Digikey: RHM.11UCT-ND
S1 = vmuzero:SWITCH-SPDT: Single Pole, Double Throw (SPDT) Switch Single-pole, double-throw (SPDT) switch.; DIGIKEY: 401-1999-1-ND; MPN: JS102011SAQN; SUPPLIER: C&K
TP1 TP2 TP4 TP6 TP7 TP9 TP11-TP16 TP18-TP20 TP22-TP24 TP29 TP30 TP32 TP34 TP36 TP37 TP39 = testpad:TP: Test pad
U1 = vmuzero:MCP73833: MCP73833 Li-Ion, Li-Pol Controller Stand-Alone Linear Li-Ion / Li-Polymer Charge Management Controller Datasheet <http://ww1.microchip.com/downloads/en/DeviceDoc/22005b.pdf>
U2 = vmuzero:TLV61046A: 28V BOOST CONVERTER WITH INTEGRATED SWITCH AND POWER DIODE; DIGIKEY: 296-46927-1-ND; PACKAGE: SOT-23-6; SUPPLIER: Texas Instruments
U3 = vmuzero:DISP_OLED_DD-160128FC-2B: 128x160 1.45" RGB OLED - DD-160128FC-2B 35-Pin 0.5mm Pitch FPC Cable (Top+Bottom Contacts) - OMRON XF2M-3515-1A (Digikey: OR727TR-ND) This FPC connector has contacts on the top and bottom, but the appropriate pin needs to be selected depending on whether the OLED will be inserted right-side up (use the NOSWAP pinout) or upside-down (use the SWAP pinout).; DIGIKEY: OR727TR-ND; MPN: XF2M-3515-1A; SUPPLIER: Omron Electronics
U5 = vmuzero:RPI-ZERO_OUTLINE
U6 = vmuzero:MIC94064: MIC94064/5 1.7V to 5.5V High Side Switch Source: http://ww1.microchip.com/downloads/en/DeviceDoc/mic94064-5.pdf
U7 = vmuzero:LM358: OP AMP also LM158; LM258; LM2904 Source: http://cache.national.com/ds/LM/LM158.pdf

## Board
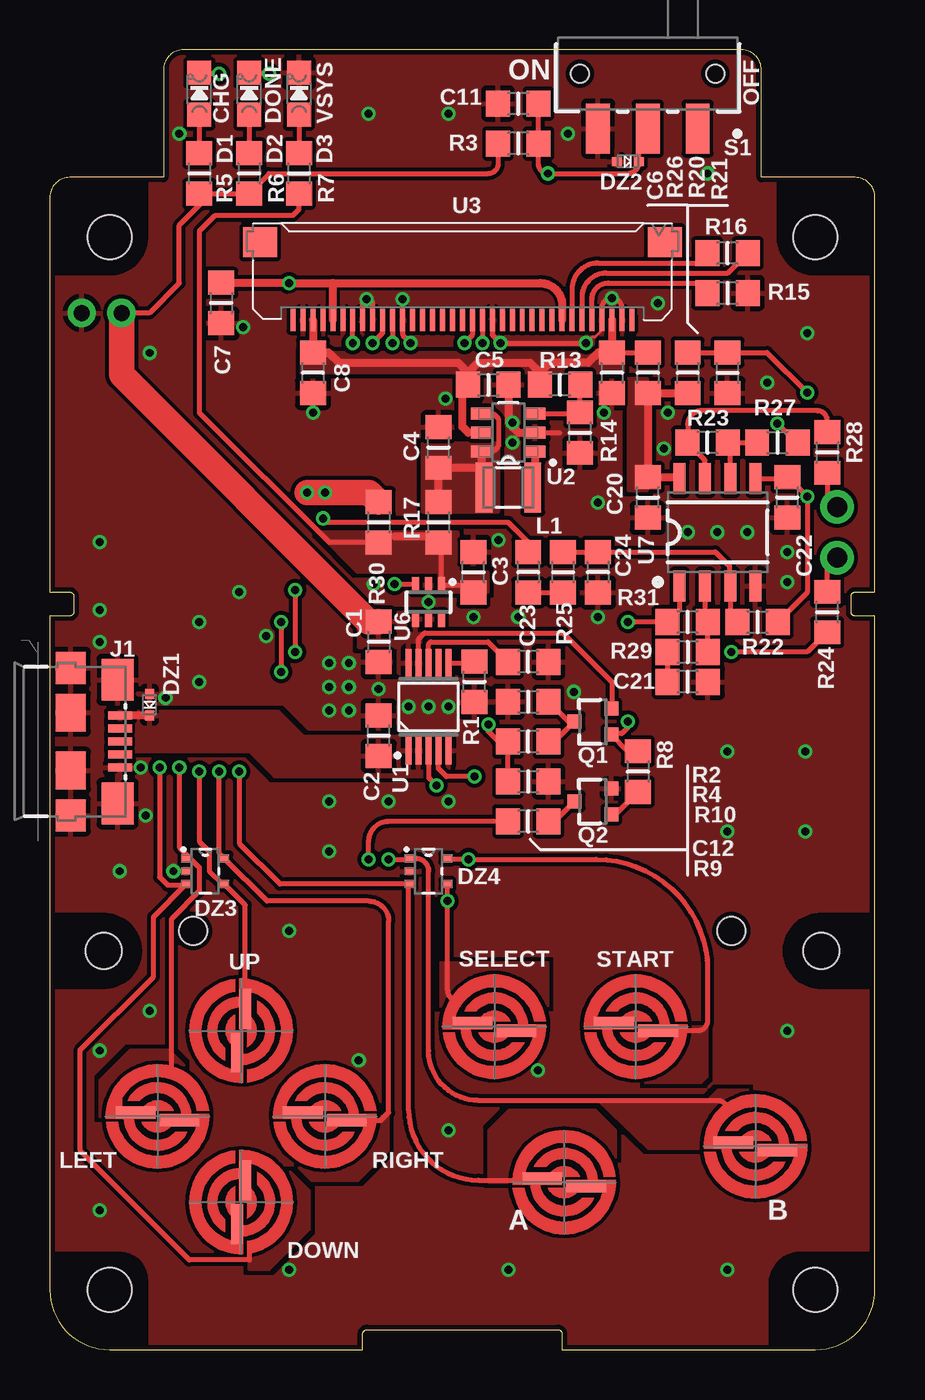
[diagram p5: board, top side]
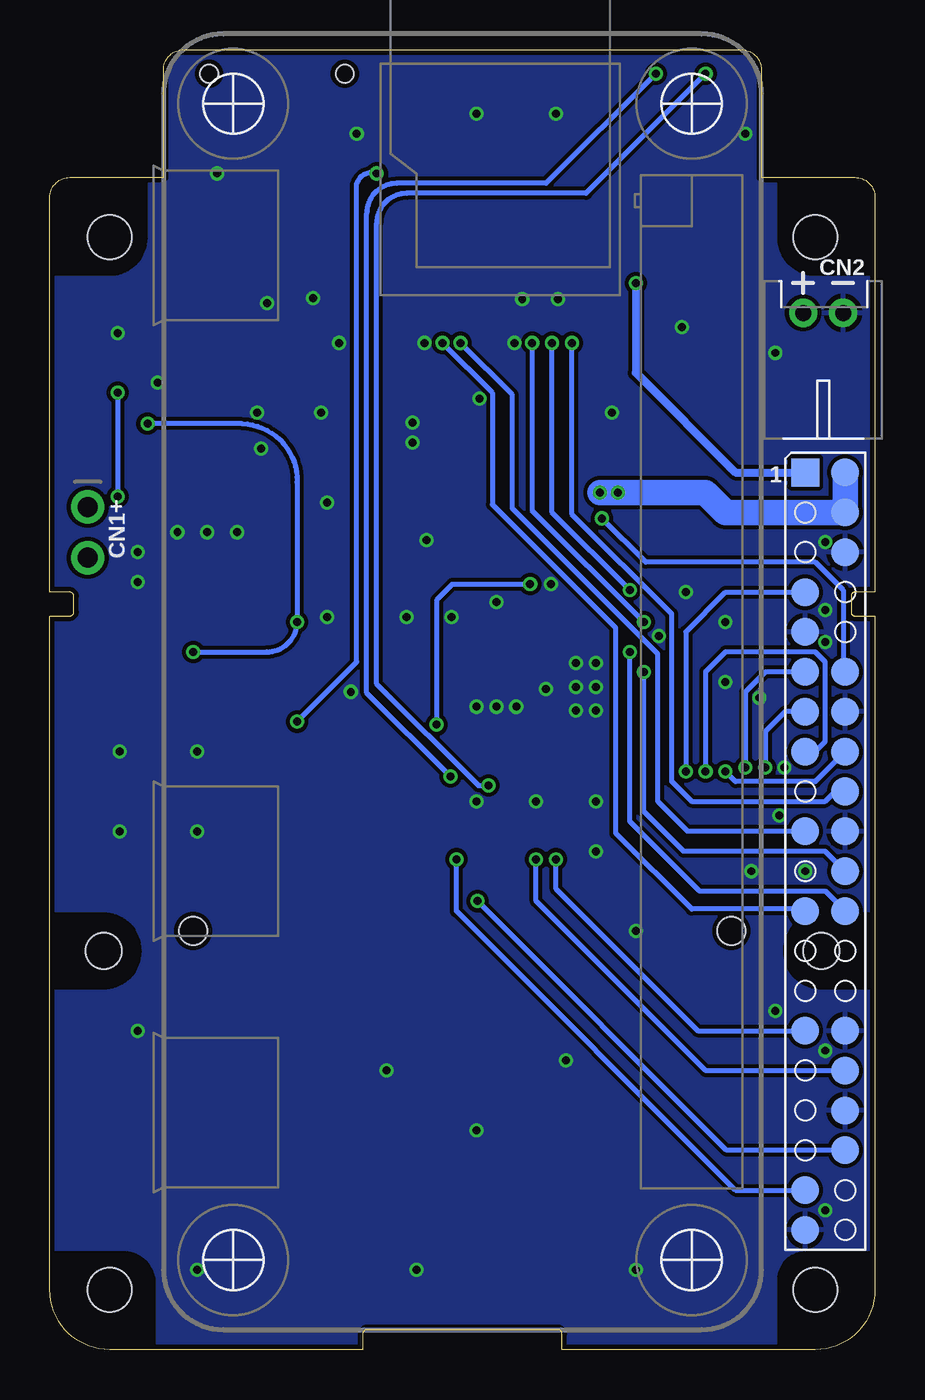
[diagram p6: board, bottom side, seen from below]

Size 41.4 x 65.2 mm. Coordinates in mm from the lower left corner, seen from the top.
Outline: 3,0 15.7,0 15.7,0.8 arc-90 15.9,1 25.5,1 arc-90 25.7,0.8 25.7,0 38.4,0 arc90 41.4,3 41.4,36.8 40.4,36.8 arc-90 40.2,37 40.2,37.8 arc-90 40.4,38 41.4,38 41.4,57.8 arc90 40.4,58.8 35.7,58.8 35.7,64.2 arc90 34.7,65.2 6.7,65.2 arc90 5.7,64.2 5.7,58.8 1,58.8 arc90 0,57.8 0,38 1,38 arc-90 1.2,37.8 1.2,37 arc-90 1,36.8 0,36.8 0,3 arc90 3,0
Copper layers (1*16): Top 0.035mm / dielectric 1.5mm / Bottom 0.035mm
Design rules "SeeedStudio_2layer_DRU_no_angle_20140221 *": minimum track width 6mil, minimum drill 12mil, track to track 6mil, track to pad 6mil, pad to pad 6mil, via to via 6mil, smd to smd 0mil, copper to edge 10mil, drill to drill 12mil, minimum pad ring 10mil, minimum via ring 6mil, stop-mask expansion 2mil, vias tented up to drill 100mil, thermal gap 10mil
Holes 2.2 mm at 3,3 38.4,3 3,55.8 38.4,55.8
Holes 1.8 mm at 2.7,20 38.7,20
Holes 1.4 mm at 7.2,21 34.2,21
tKeepout: area 0,20 to 41.4,22
tRestrict: area 18.2,29.4 to 18.3,30.7; area 18.2,33.8 to 18.3,35.1; 1 lines

### Footprints (pad centres in the part's own frame; a part is rotated, then mirrored left to right if it is on the bottom)
KEYPAD_VMU_R26 = smd 0.6 x 2: 1 -0.2,-1.1; 2 0.2,1.1
_0805MP = smd 1.2 x 1.3: 1 -1.016,0; 2 1.016,0
1X02_ROUND = drill 1 pad 1.676: 1 -1.27,0; 2 1.27,0
S2B-PH-K-S = drill 0.8 pad 1.422: 1 1,0; 2 -1,0
CHIPLED_0805_NOOUTLINE = smd 1.2 x 1.2: A 0,-1.05; C 0,1.05
DIODE_SOD723 = smd 0.5 x 0.45: A 0.55,0; C -0.55,0
SC70-5 = smd 0.5 x 0.4: 1 -0.95,0.65; 2 -0.95,0; 3 -0.95,-0.65; 4 0.95,-0.65; 5 0.95,0.65
USB-MICROB_10118192 = smd 1.2 x 0.4: D+ 2.675,0; D- 2.675,0.65; GND 2.675,-1.3; ID 2.675,-0.65; VBUS 2.675,1.3 | smd 1.5 x 1.6: SHIELD1 0.2,3.7; SHIELD6 0.2,-3.7 | smd 1.6 x 2.1: SHIELD2 2.55,3.1; SHIELD5 2.55,-3.1 | smd 1.5 x 1.9: SHIELD3 0.2,1.45; SHIELD4 0.2,-1.45
CIG22L = smd 0.85 x 2.5: P$1 -1.225,0; P$2 1.225,0
SOT323 = smd 0.7 x 0.7: 1 -0.65,-0.925; 2 0.65,-0.925; 3 0,0.925
SPDT_JS102011SAQN = smd 1.2 x 2.5: P$1 -2.5,2.75; P$2 0,2.75; P$3 2.5,2.75 | hole 0.9: -3.4,0; 3.4,0
TP14SQ = smd 1.4 x 1.4: TP 0,0
TP14R = smd 1.4 x 1.4: TP 0,0
10L_MSOP = smd 0.3 x 1.4: 1 -1,-2.2; 2 -0.5,-2.2; 3 0,-2.2; 4 0.5,-2.2; 5 1,-2.2; 6 1,2.2; 7 0.5,2.2; 8 0,2.2; 9 -0.5,2.2; 10 -1,2.2
R-PDSO-G6 = smd 1.05 x 0.6: 1 -1.35,0.95; 2 -1.35,0; 3 -1.35,-0.95; 4 1.35,-0.95; 5 1.35,0; 6 1.35,0.95
XF2M-3515-1A = smd 1.1 x 0.25: 1 3.15,8.5; 2 3.15,8; 3 3.15,7.5; 4 3.15,7; 5 3.15,6.5; 6 3.15,6; 7 3.15,5.5; 8 3.15,5; 9 3.15,4.5; 10 3.15,4; 11 3.15,3.5; 12 3.15,3; 13 3.15,2.5; 14 3.15,2; 15 3.15,1.5; 16 3.15,1; 17 3.15,0.5; 18 3.15,0; 19 3.15,-0.5; 20 3.15,-1; 21 3.15,-1.5; 22 3.15,-2; 23 3.15,-2.5; 24 3.15,-3; 25 3.15,-3.5; 26 3.15,-4; 27 3.15,-4.5; 28 3.15,-5; 29 3.15,-5.5; 30 3.15,-6; 31 3.15,-6.5; 32 3.15,-7; 33 3.15,-7.5; 34 3.15,-8; 35 3.15,-8.5 | smd 1.5 x 1.7: M1 -0.75,10.15; M2 -0.75,-10.15
SC70-6L = smd 0.35 x 0.8: 1 -0.65,-0.85; 2 0,-0.85; 3 0.65,-0.85; 4 0.65,0.85; 5 0,0.85; 6 -0.65,0.85
SO08 = smd 0.6 x 1.55: 1 -1.905,-2.7; 2 -0.635,-2.7; 3 0.635,-2.7; 4 1.905,-2.7; 5 1.905,2.7; 6 0.635,2.7; 7 -0.635,2.7; 8 -1.905,2.7

### Placement (x,y rotation side)
A  25.8,8.4 270 top
B  35.4,10.2 270 top
C1  16.5,35.5 270 top
C2  16.5,30.8 90 top
C3  21.25,39 90 top
C4  19.5,45.25 90 top
C5  22,48.4 0 top
C6  28.2,49 270 top
C7  8.6,52.5 270 top
C8  13.2,49 270 top
C11  23.5,62.5 180 top
C12  24,28.5 0 top
C20  30,42.75 90 top
C21  32,33.5 180 top
C22  37,42.75 90 top
C23  24,39 270 top
C24  27.5,39 270 top
CN1  39.5,41 270 bottom
CN2  2.6,52 180 bottom
D1  7.5,63 0 top
D2  10,63 0 top
D3  12.5,63 0 top
DOWN  9.6,7.4 180 top
DZ1  5,32.35 90 top
DZ2  29,59.6 180 top
DZ3  7.8,24 0 top
DZ4  19,24 0 top
J1  0.85,30.5 0 top
L1  23,43.25 0 top
LEFT  5.4,11.7 270 top
Q1  27.25,31.5 90 top
Q2  27.25,27.5 90 top
R1  21.3,33.5 90 top
R2  24,34.5 180 top
R3  23.5,60.5 180 top
R4  24,32.5 0 top
R5  7.5,59 270 top
R6  10,59 270 top
R7  12.5,59 270 top
R8  29.5,29 270 top
R9  24,26.5 180 top
R10  24,30.5 180 top
R13  25.6,48.4 180 top
R14  26.6,46 90 top
R15  34,53 0 top
R16  34,55 180 top
R17  19.5,41.5 270 top
R20  32,49 270 top
R21  34,49 90 top
R22  35.5,36.5 0 top
R23  33,45.5 180 top
R24  39,37 90 top
R25  25.75,39 90 top
R26  30,49 270 top
R27  36.5,45.5 0 top
R28  39,45 270 top
R29  32,35 0 top
R30  16.5,41.5 270 top
R31  32,36.5 180 top
RIGHT  13.8,11.7 270 top
S1  30,64 180 top
SELECT  22.3,16.2 270 top
START  29.4,16.2 90 top
TP1  3.5,44 0 bottom
TP2  1.5,44 0 bottom
TP4  1.5,42 0 bottom
TP6  1.5,40 0 bottom
TP7  3.5,38 0 bottom
TP9  3.5,36 0 bottom
TP11  3.5,34 0 bottom
TP12  1.5,34 0 bottom
TP13  3.5,32 0 bottom
TP14  1.5,32 0 bottom
TP15  3.5,30 0 bottom
TP16  1.5,30 0 bottom
TP18  1.5,28 0 bottom
TP19  3.5,26 0 bottom
TP20  1.5,26 0 bottom
TP22  1.5,24 0 bottom
TP23  3.5,22 0 bottom
TP24  1.5,22 0 bottom
TP29  3.5,16 0 bottom
TP30  1.5,16 0 bottom
TP32  1.5,14 0 bottom
TP34  1.5,12 0 bottom
TP36  1.5,10 0 bottom
TP37  3.5,8 0 bottom
TP39  3.5,6 0 bottom
U1  19,32.25 0 top
U2  23,46 180 top
U3  20.7,54.8 270 top
U5  9.2,33.5 270 bottom
U6  19,37.5 180 top
U7  33.5,41 0 top
UP  9.6,16 0 top

### Tracks (layer width: path | path; a pad name or v marks a point on that pad's centre or on a via)
3.3V  (via drill 0.4)
  Top 0.406: 14.2,53.5 v12,53.5 11.98,53.52 C7.1 | 14.2,53.5 24.6,53.5 arc-90 25.7,52.4 U3.8 | U3.31 14.2,53.5
  Bottom 0.406: v12,53.5 12,49 7,44 TP1.TP
14V
  Top 0.254: C5.1 20.98,49 | 24.6,49 24.6,48.42 R13.2 | C6.1 R26.1
  Top 0.406: U3.33 C8.1 13.98,50.02 14.5,49.5 20.48,49.5 20.98,49 21.48,49.5 24.1,49.5 24.6,49 25.1,49.5 27,49.5 27.52,50.02 C6.1 U3.3 | U2.5 21,46 20.7,46.3 20.7,48.12 C5.1
  pour Top (isolate 0.203, rank 2, no thermals): 12.6,49 28.8,49 28.8,50 12.6,50
GND  (via drill 0.4)
  Top 0.152: U3.4 27.7,51.15 27.35,50.8 27.2,50.8 v26.9,50.5
  Top 0.254: U2.2 25.58,46 | U3.4 27.7,52.25 arc-90 v28.2,52.75 arc-90 28.7,52.25 U3.2 | U3.15 22.2,50.9 v22.6,50.5 v26.9,50.5 | v18.1,50.5 17.7,50.9 U3.24 v17.7,52.7 | U3.28 15.7,52.5 arc-90 v15.9,52.7 arc-90 16.2,52.4 U3.27
  Top 0.406: C5.2 23.02,46.48 23.5,46 U2.2
  other vias: 30.5,52.5 23,4 34,4 12,4 27.8,47 9.7,51.3 6.2,24 37,16 2.5,35.5 6.5,61 23.2,46.5 23.2,45.5 19.85,47.7 4.55,29.2 2.5,7 15.5,14.5 20,11 24.5,14 13.2,47 9.5,38 2.5,40.5 2.5,37.1 30.8,45.2 31,47 5.8,32.7 15,34.45 15,32.05 15,33.25 14,33.25 14,32.05 16.25,38.4 16.5,33.15 19,32.25 18,32.25 20,32.25 21.25,36.75 33.5,41 35,41 32,41 37,40 37,38.5 34,30 37.9,30 37.9,26 34,26 14,27.5 20,27.5 17,27.5 14,25 36,48.5 38,51 16,62 20,62 26,61 33,59 22.5,40.6 19,37.5 23.5,36.75 27.5,42.5 26.3,33 4.8,26.8 5,17 2.5,15 7.5,33.5 27.5,36.75 5,50 14,34.45 7.5,36.5 3.5,24 10.85,35.8 12,21
  pour Top (isolate 0.203, rank 6): 0,5 3.5,5 arc-90 5,3.5 5,0 36,0 36,3.5 arc-90 37.9,5 41.4,5 41.4,18 38.7,18 arc-90 36.7,20 arc-90 38.7,22 41.4,22 41.4,53.8 38.4,53.8 arc-90 36.4,55.8 36.4,65.2 5,65.2 5,55.8 arc-90 3,53.8 0,53.8 0,22 2.7,22 arc-90 4.7,20 arc-90 2.7,18 0,18
  pour Top: 12,52 32,52 32,53.5 12,53.5
  pour Bottom (isolate 0.203, rank 6): 0,5 3.5,5 arc-90 5,3.5 5,0 36,0 36,3.5 arc-90 37.9,5 41.4,5 41.4,18 38.7,18 arc-90 36.7,20 arc-90 38.7,22 41.4,22 41.4,53.8 38.4,53.8 arc-90 36.4,55.8 36.4,65.2 5,65.2 5,55.8 arc-90 3,53.8 0,53.8 0,22 2.7,22 arc-90 4.7,20 arc-90 2.7,18 0,18
  pour Top (rank 6, no thermals): 5.5,3 5.5,1.25 35.5,1.25 35.5,3
KEY_A  (via drill 0.4)
  Top 0.254: 24.6,8.5 A.1 arc-90 24.6,8.5 | 24.6,8.5 21.5,8.5 arc-90 18,12 18,23.3 DZ4.3 11.55,23.35 9.5,25.4 v9.5,29
  Bottom 0.254: v9.5,29 9.5,36 7.5,38 TP7.TP
  pour Top (isolate 0.203): 22,8.4 25.7,8.4 25.7,8.8 28.4,8.8 28.4,11 27.4,12 23,12 22,11
KEY_B  (via drill 0.4)
  Top 0.254: v17,24.6 18,24.6 DZ4.1 18.35,24.65 arc-90 19,24 19,15 arc90 21.5,12.5 33.5,12.5 arc-90 34,12 33,10.5 B.1
  Bottom 0.254: v17,24.6 17,22.5 8.5,14 TP32.TP
  pour Top (isolate 0.203, no thermals): 30,10.1 35.3,10.1 35.3,10.6 38.1,10.6 38.1,12.6 37.7,13 33.5,13 33,12.5 27.5,12.5
KEY_DOWN  (via drill 0.4)
  Top 0.254: DOWN.1 10,9.5 10.5,9.5 12,8 12,7 11.5,6 11,5.5 10,5 10,4.5 7,4.5 1.5,10 1.5,15 5.2,18.7 5.2,21.7 DZ3.3 6.8,23.3 5.9,23.3 5.5,23.7 v5.5,29.2
  Bottom 0.254: TP13.TP 4.5,32 5.5,31 v5.5,29.2
  pour Top (isolate 0.203): 10,4 10,7.5 9.6,7.5 9.6,10.3 10.7,10.3 13,8 13,6 11,4
KEY_LEFT  (via drill 0.4)
  Top 0.254: LEFT.1 4.2,12 3.3,12 3.5,12.2 3.5,13 4.5,14 6,14 6.1,14.1 6.1,21.6 7.5,23 7.5,24.2 6.9,24.8 | v6.5,29.2 6.5,25.2 6.9,24.8 | DZ3.1 6.85,24.75 6.9,24.8
  Bottom 0.254: TP11.TP 5.5,34 6.5,33 v6.5,29.2
  pour Top (isolate 0.203): 2.5,11.7 5.4,11.7 5.4,12.1 8,12.1 8,13 6,15 4,15 2.5,13.5
KEY_RIGHT  (via drill 0.4)
  Top 0.254: RIGHT.2 16.6,11.5 17,11.9 17,21.5 arc90 16,22.5 10.9,22.5 DZ3.5 8.5,24.9 v8.5,29
  Bottom 0.254: TP15.TP 3,30 2.5,30.5 2.5,34.5 3,35 7.5,35 8.5,34 v8.5,29
  pour Top (isolate 0.203): 17,11.7 13.9,11.7 13.9,11.3 11.2,11.3 11.2,10.4 13.1,8.5 15.5,8.5 17,10
KEY_SELECT  (via drill 0.4)
  Top 0.254: DZ4.4 v19.95,22.5 19.95,18.05 arc90 20.5,17.5 20,17 20,16.5 20.1,16.4 SELECT.1
  Bottom 0.254: v19.95,22.5 7.45,10 TP36.TP
  pour Top (isolate 0.203, no thermals): 19.6,16.2 22.2,16.2 22.2,16.6 25,16.6 25,19.4 19.6,19.4
KEY_START  (via drill 0.4)
  Top 0.254: DZ4.5 20,24.6 v21,24.6 27.4,24.6 arc-90 33,19 33,16.5 arc-90 32.5,16 START.1
  Bottom 0.254: v21,24.6 21,22 7,8 TP37.TP
  pour Top (isolate 0.203): 33,16.2 29.4,16.2 29.4,15.9 26,15.9 26,13.8 26.4,13.4 32.7,13.4 33,13.7
KEY_UP  (via drill 0.4)
  Top 0.254: UP.2 9.8,22.3 DZ3.4 8.65,23.35 8,24 8,25 7.5,25.5 v7.5,29
  Bottom 0.254: TP16.TP 3,28.5 7,28.5 v7.5,29
  pour Top (isolate 0.203, no thermals): 11.3,18.7 9.6,18.7 9.6,16 10,16 10,13.3 11,13.3 13,15.3 13,17
N$1
  Top 0.254: D1.A R5.1
N$2
  Top 0.254: R9.1 25.32,26.5 Q2.3
N$3
  Top 0.254: C23.2 R25.1
N$5
  Top 0.254: D3.A R7.1
N$6
  Top 0.254: D2.A R6.1
N$7
  Top 0.254: U3.5 27.2,52.7 arc-90 28,53.5 33,53.5 33,53.02 R15.1
N$8
  Top 0.406: U2.1 24.35,43.22 L1.P$2
N$9
  Top 0.254: R13.1 26.6,48.38 R14.2 26.53,46.95 U2.3
N$10
  Top 0.254: R16.1 34.02,54 27.9,54 arc90 26.7,52.8 U3.6
N$11
  Top 0.254: R16.2 32.48,54.5 27.5,54.5 arc90 26.2,53.2 U3.7
N$12
  Top 0.254: U7.2 32.87,36.65 R31.1 R29.2
N$13
  Top 0.254: R29.1 C21.2
N$16
  Top 0.254: R27.1 R23.1 34.13,45.38 U7.6
N$20
  Top 0.254: R25.2 C24.1 33.38,40.02 34.1,39.3 34.1,38.34 U7.3 34.13,36.85 R22.1
N$21
  Top 0.254: Q2.1 28.37,26.85 R8.2
N$22
  Top 0.254: R10.1 25.32,30.5 Q1.3 26.02,31.5 R4.2
OLED_CS  (via drill 0.4)
  Top 0.254: v16.2,50.5 16.7,51 U3.26 | v12.3,38.1 v12.3,35
  Bottom 0.254: v16.2,50.5 16.2,42 v12.3,38.1 | TP24.TP 2.5,23 8.8,23 12.3,26.5 v12.3,35
OLED_DC  (via drill 0.4)
  Top 0.254: U3.25 v17.2,50.5 | v11.6,36.5 v11.6,34
  Bottom 0.254: v17.2,50.5 17.2,42.1 v11.6,36.5 | TP22.TP 2.5,25 9.6,25 11.6,27 v11.6,34
OLED_MOSI  (via drill 0.4)
  Top 0.254: U3.17 21.2,50.9 v20.8,50.5
  Bottom 0.254: v20.8,50.5 18.2,47.9 18.2,42.2 10.9,34.9 10.9,27.5 9.4,26 TP19.TP
OLED_RES  (via drill 0.4)
  Top 0.254: v15.2,50.5 U3.29
  Bottom 0.254: v15.2,50.5 15.2,41.9 10.2,36.9 10.2,28.5 9.2,27.5 2.5,27.5 2.1,27.9 1.6,27.9 TP18.TP
OLED_SCLK  (via drill 0.4)
  Top 0.254: U3.16 v21.7,50.5
  Bottom 0.254: v21.7,50.5 19.2,48 19.2,42.4 13,36.2 13,25.9 9.2,22.1 3.6,22.1 TP23.TP 4,22
PM_NTC
  Top 0.254: 22.98,34.72 R2.2 21.98,35.5 19.1,35.5 19,35.4 U1.8
PM_PROG
  Top 0.254: 21.23,34.7 R1.2 21.18,34.45 U1.6
PM_SHUTDOWN  (via drill 0.4)
  Top 0.254: R9.2 17,26.5 arc90 16,25.5 v16,24.6
  Bottom 0.254: v16,24.6 16,23.1 8.9,16 TP29.TP
PM_STAT1  (via drill 0.4)
  Top 0.254: v8.5,64 7.55,64 D1.C | U1.3 19,28.7 v19.4,28.3
  Bottom 0.254: v8.5,64 14.5,58 23.5,58 arc-90 25,56.5 25,33.4 19.9,28.3 v19.4,28.3
PM_STAT2  (via drill 0.4)
  Top 0.254: v21.3,28.75 19.9,28.75 19.5,29.15 U1.4 | v11,64 10.05,64 D2.C
  Bottom 0.254: v11,64 16.5,58.5 24,58.5 arc-90 25.5,57 25.5,32.95 v21.3,28.75
PM_SYSON  (via drill 0.4)
  Top 0.254: C12.1 R10.2 22.88,30.6 22.4,30.6 22,31 v22,31.35 | v17.3,38.4 18.3,38.4 U6.3
  Bottom 0.254: v17.3,38.4 21.2,38.4 22,37.6 v22,31.35
PM_SYSON_L  (via drill 0.4)
  Top 0.254: S1.P$2 29.55,60.8 DZ2.C arc-90 29.05,59 v25,59 arc-90 24.5,59.5 24.5,60.48 arc-90 R3.1 C11.1 | R8.1 29.01,30.02 Q1.1 28.23,30.9 28.7,30.9 29,31.2 v29,31.5
  Bottom 0.254: v25,59 arc-90 26,58.5 26,34.5 v29,31.5
PWM0  (via drill 0.4)
  Top 0.254: C23.1 24,40.5 23,41.5 13.9,41.5 v13.7,41.7
  Bottom 0.254: TP12.TP 1.6,34.1 1.6,38.1 3,39.5 11.5,39.5 v13.7,41.7
V_AMP_CM  (via drill 0.4)
  Top 0.254: R20.1 R21.2 35.98,50.02 v38,48 | 36.5,36.52 R22.2 38,37.98 v38,42.8 37.03,43.77 C22.2 | 37.07,43.7 C22.2 | U7.5 36.93,43.7 C22.2
  Bottom 0.254: v38,48 v38,42.8
V_BATT
  Top 0.254: R5.2 R6.2 10,58 11,59 22,59 arc90 22.5,59.5 22.5,60.48 R3.2 | U1.9 18.5,35.65 18.8,35.95 25.75,35.95 28.2,33.5 28.2,32.17 Q1.2 | R5.2 7.5,57.5 | CN2.1 5,52 6.5,53.5 6.5,56.4 7.5,57.4 R5.2
  Top 1.27: 16.48,36.52 C1.1 16.48,36.5 16,36.5 3.6,48.9 CN2.1
  pour Top (rank 2): 15.5,37 18.6,37 18.6,33.9 17.5,33.9 17.5,35.2 15.5,35.2
V_USB
  Top 0.406: 16.32,29.6 C2.1 | 4.8,31.8 3.2,31.8
  pour Top (rank 2): 18.7,28.75 18.7,30.7 17.5,30.7 17.5,30.75 12.75,30.75 11.5,32 3,32 3,30 10,30 11.25,28.75
VOUTN
  Top 0.254: U7.7 32.87,44.62 R23.2 32,45.52 32,46.4 arc-90 32.7,47.1 38.5,47.1 arc-90 39,46.6 R28.1
VOUTN_R
  Top 0.254: R28.2 39,42.77 CN1.1
VOUTP  (via drill 0.4)
  Top 0.254: R24.1 38.98,35.98 38,35 v34.2,35 | v36.5,46.45 37.5,45.52 R27.2 | U7.1 31.59,37.11 R31.2 v29,36.5
  Bottom 0.254: v34.2,35 30.5,35 arc-90 v29,36.5 29,43.5 arc-90 31.75,46.45 v36.5,46.45
VOUTP_R
  Top 0.254: R24.2 39,39.23 CN1.2
VSYS
  Top 0.254: R7.2 12.5,57.2 12.2,56.9 8.3,56.9 7.5,56.1 7.5,47 14,40.5 16.48,40.5 R30.2 | R17.2 19.65,39.83 U6.1 21.13,38.35 C3.1
  Top 0.406: 19.28,40.7 R17.2 19.18,40.8 17.3,40.8
  pour Top (rank 2, no thermals): 13.4,41 15.4,39 19.5,39 19.5,38 22,38 22,39 20.5,39 20.5,41
VSYS_AMP
  Top 0.406: R20.2 R26.2 C20.2 31.53,43.77 U7.8
  pour Top (rank 2, no thermals): 29,43.1 30,43.1 30,48.7 29,48.7
VSYS_LCD
  Top 0.254: U2.4 22.25,46.95 22.5,46.7 22.5,45.3 22.3,45.1 21.7,45.1 U2.6 21.58,44.98
  Top 0.406: U2.6 21.65,44.2 | 21.65,44.2 21.65,43.71 L1.P$1 | R17.1 C4.1 21.62,44.23 21.65,44.2
  pour Top (isolate 0.203, rank 2, no thermals): 22.5,45.5 22.5,42 18.7,42 18.7,45.5
VSYS_RPI  (via drill 0.4)
  Top 1.27: v12.9,43 v13.8,43 16.02,43 R30.1
  Bottom 1.27: TP2.TP TP4.TP 7.5,42 8.5,43 v13.8,43

### Text on the board
tPlace: ON | CHG | DONE | VSYS | OFF
bPlace: 1 | +
tRestrict: VMU Zero V2.0 | hemkop11@gmail.com
Measures: All dimensions in mm